# Altium schematic sheet temperature.SchDoc
size A4
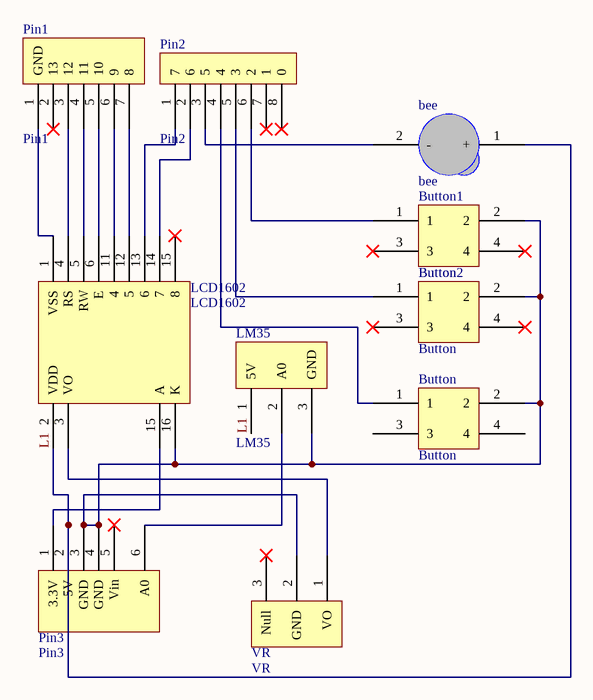
[diagram p0: temperature.SchDoc]

## Parts
bee  bee  [bee]
Button  Button  [button]
Button1  Button  [button]
Button2  Button  [button]
LCD1602  LCD1602  [LCD1602]
LM35  LM35  [LM35]
Pin1  Pin1  [Pin1]
Pin2  Pin2  [Pin2]
Pin3  Pin3  [Pin3]
VR  VR  [VR]

## Nets
L1: bee.1(+) LCD1602.2(VDD) LM35.1(5V) Pin3.2(5V)
Netbee_2: bee.2(-) Pin2.3(5)
NetButton1_1: Button1.1 Pin2.6(2)
NetButton2_1: Button2.1 Pin2.5(3)
NetButton_1: Button.1 Pin2.4
NetButton_2: Button.2 Button1.2 Button2.2 LCD1602.16(K) LM35.3(GND) Pin3.3(GND) Pin3.4(GND) VR.2(GND)
NetLCD1602_1: LCD1602.1(VSS) Pin1.1(GND)
NetLCD1602_3: LCD1602.3(VO) VR.1(VO)
NetLCD1602_4: LCD1602.4(RS) Pin1.3(12)
NetLCD1602_5: LCD1602.5(RW) Pin1.4(11)
NetLCD1602_6: LCD1602.6(E) Pin1.5(10)
NetLCD1602_11: LCD1602.11(4) Pin1.6(9)
NetLCD1602_12: LCD1602.12(5) Pin1.7(8)
NetLCD1602_13: LCD1602.13(6) Pin2.1(7)
NetLCD1602_14: LCD1602.14(7) Pin2.2(6)
NetLCD1602_15: LCD1602.15(8) Pin3.1(3.3V)
NetLM35_2: LM35.2(A0) Pin3.6(A0)

Not connected (* = marked no-connect by the designer): Button 3 4; Button1 3* 4*; Button2 3* 4*; Pin1 2(13)*; Pin2 7(1)* 8(0)*; Pin3 5(Vin)*; VR 3(Null)*